# EAGLE design EncoderWing (EAGLE 6.3)
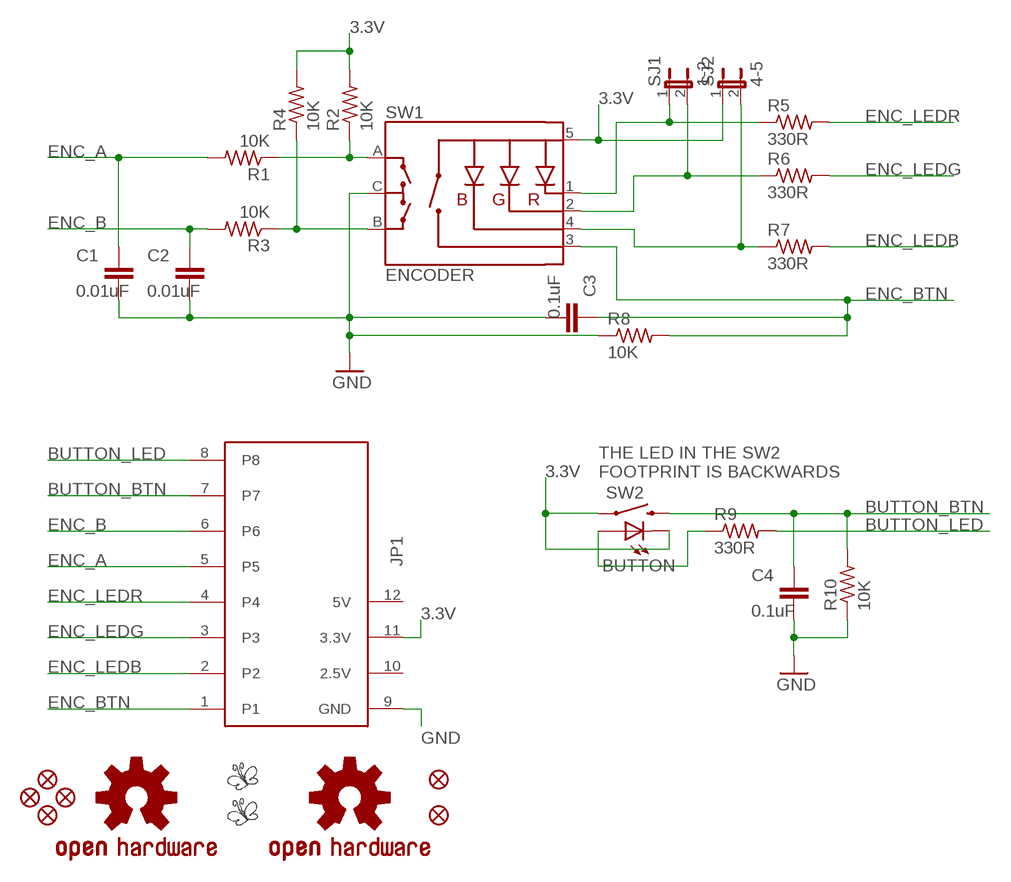
[diagram p0: schematic, sheet 1]

## Parts
C1  0.01uF  C-EUC0603  [C0603]
C2  0.01uF  C-EUC0603  [C0603]
C3  0.1uF  C-EUC0603  [C0603]
C4  0.1uF  C-EUC0603  [C0603]
FID1  FIDUCIALUFIDUCIAL  [MICRO-FIDUCIAL]
FID2  FIDUCIALUFIDUCIAL  [MICRO-FIDUCIAL]
FID3  FIDUCIALUFIDUCIAL  [MICRO-FIDUCIAL]
FID4  FIDUCIALUFIDUCIAL  [MICRO-FIDUCIAL]
FID5  FIDUCIALUFIDUCIAL  [MICRO-FIDUCIAL]
FID6  FIDUCIALUFIDUCIAL  [MICRO-FIDUCIAL]
JP1  PAPILIO-WING-8BITS  [PAPILIO-WING-8BITS]
LOGO1  BUTTERFLY_LOGO  [BUTTERFLY_LOGO]
LOGO2  BUTTERFLY_LOGO  [BUTTERFLY_LOGO]
R1  10K  R-US_R0603  [R0603]
R2  10K  R-US_R0603  [R0603]
R3  10K  R-US_R0603  [R0603]
R4  10K  R-US_R0603  [R0603]
R5  330R  R-US_R0603  [R0603]
R6  330R  R-US_R0603  [R0603]
R7  330R  R-US_R0603  [R0603]
R8  10K  R-US_R0603  [R0603]
R9  330R  R-US_R0603  [R0603]
R10  10K  R-US_R0603  [R0603]
SJ1  1-2  JUMPER-2SMD-NO  [SJ_2S-NO]
SJ2  4-5  JUMPER-2SMD-NO  [SJ_2S-NO]
SW1  ENCODER  ENCODER_RGB_CA  [ENCODER_LED_3]
SW2  BUTTON  SWITCH-MOMENTARY-LEDPTH  [TACTILE-PTH-LED-12MM]
U$2  OSHW-LOGOS  [OSHW-LOGO-S]
U$3  OSHW-LOGOS  [OSHW-LOGO-S]

## Nets
3.3V: JP1.11(3.3V) R2.2 R4.2 SJ2.1 SW1.5(+) SW2.4 SW2.C
BACK_LED_RES: R9.1 SW2.A
BUTTON_BTN: C4.1 JP1.7 R10.2 SW2.2
BUTTON_LED: JP1.8 R9.2
ENC_A: C1.1 JP1.5 R1.2
ENC_A_RES: R1.1 R2.1 SW1.A
ENC_B: C2.1 JP1.6 R3.2
ENC_B_RES: R3.1 R4.1 SW1.B
ENC_BTN: C3.1 JP1.1 R8.2 SW1.3(SW)
ENC_LEDB: JP1.2 R7.2
ENC_LEDB_RES: R7.1 SJ2.2 SW1.4(-B)
ENC_LEDG: JP1.3 R6.2
ENC_LEDG_RES: R6.1 SJ1.2 SW1.2(-G)
ENC_LEDR: JP1.4 R5.2
ENC_LEDR_RES: R5.1 SJ1.1 SW1.1(-R)
GND: C1.2 C2.2 C3.2 C4.2 JP1.9(GND) R8.1 R10.1 SW1.C
Unconnected: JP1.10(2.5V) JP1.12(5V)

## Notes on the sheet
- THE LED IN THE SW2
  FOOTPRINT IS BACKWARDS

## Library data of the parts
C1-C4 = rcl:C-EU: CAPACITOR, European symbol
FID1-FID6 = SparkFun-Aesthetics:FIDUCIAL: Fiducial Alignment Points Various fiducial points for machine vision alignment.
JP1 = logxen:PAPILIO-WING-8BITS
LOGO1 LOGO2 = GadgetFactory_Pub:BUTTERFLY_LOGO
R1-R10 = resistor:R-US_: RESISTOR, American symbol
SJ1 SJ2 = SparkFun-Passives:JUMPER-2: Jumper Basic 0.1" spaced jumper. Use with breakaway headers.
SW1 = SparkFun:ENCODER_RGB_CA: Illuminated Rotary Encoder w/ RGB LED and select switch EC12PLRGBSDVBF-D: http://top-up.so-buy.com/front/bin/ptdetail.phtml?Part=EC12PLRGBSDVBF-D
SW2 = Local Library:SWITCH-MOMENTARY-LED
U$2 U$3 = SparkFun-Aesthetics:OSHW-LOGO: Open Source Hardware Logo This logo indicates the piece of hardware it is found on incorporates a OSHW license and/or adheres to the definition of open source hardware found here: http://freedomdefined.org/OSHW

## Board
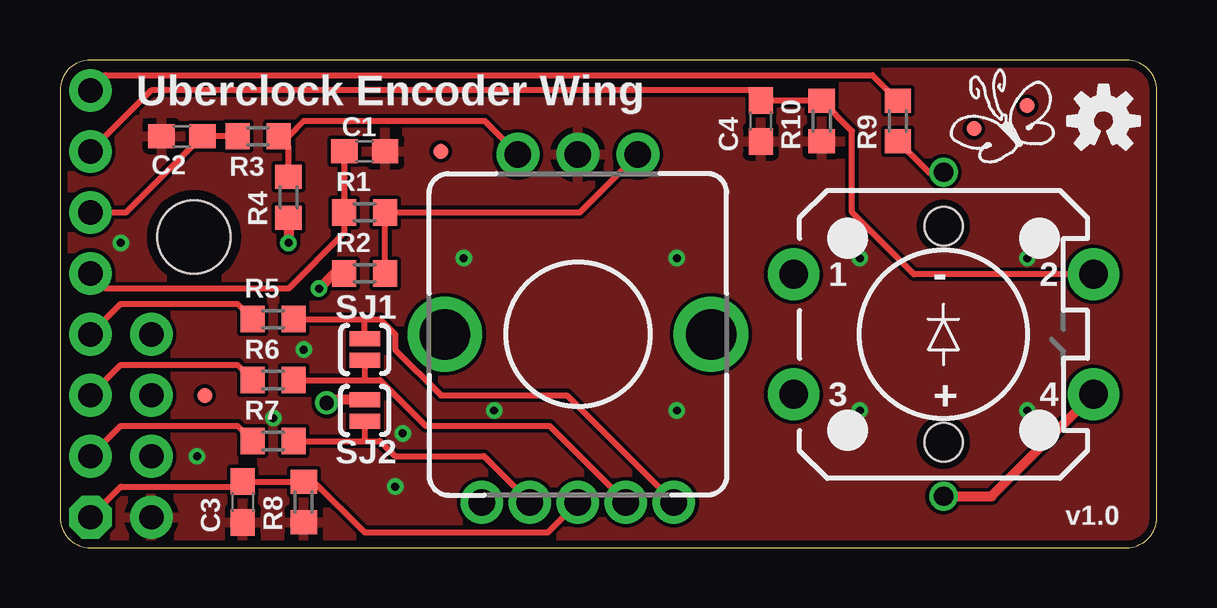
[diagram p1: board, top side]
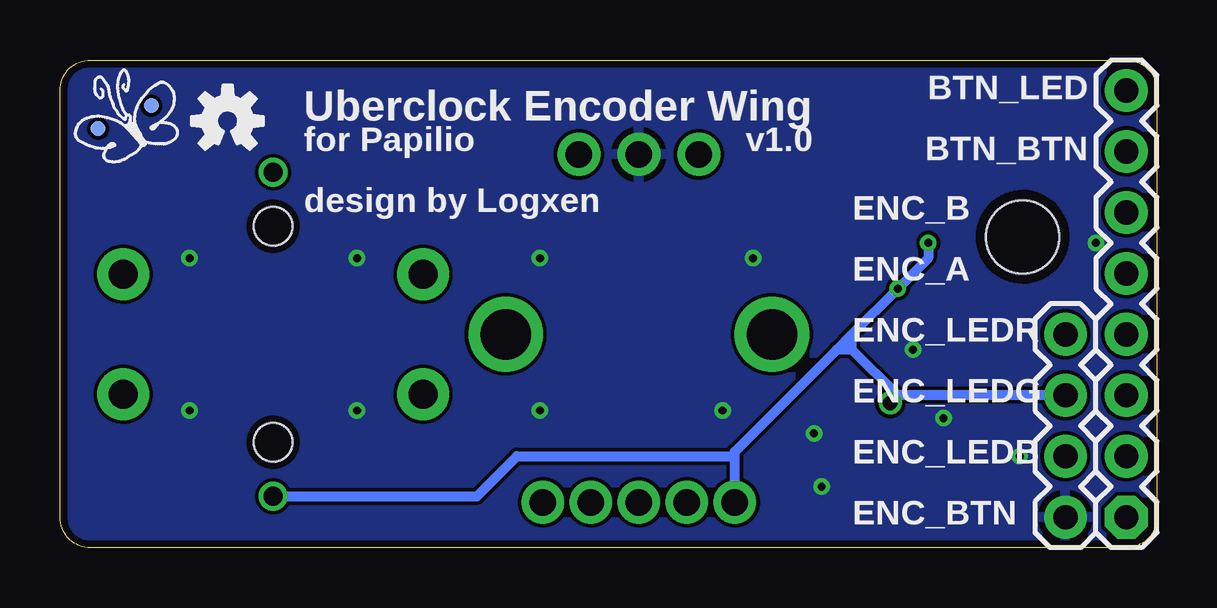
[diagram p2: board, bottom side, seen from below]

Size 45.72 x 20.32 mm. Coordinates in mm from the lower left corner, seen from the top.
Outline: 0,1.27 arc90 1.27,0 44.45,0 arc90 45.72,1.27 45.72,19.05 arc90 44.45,20.32 1.27,20.32 arc90 0,19.05 0,1.27
Copper layers (1*16): Top 0.0356mm / dielectric 1.5011mm / Bottom 0.0356mm
Design rules "LaenPCBOrder *": minimum track width 6mil, minimum drill 13mil, track to track 6mil, track to pad 6mil, pad to pad 6mil, via to via 6mil, smd to smd 6mil, copper to edge 12mil, drill to drill 6mil, minimum pad ring 7mil, minimum via ring 7mil, stop-mask expansion 4mil, vias tented up to drill 24mil, thermal gap 10mil

### Footprints (pad centres in the part's own frame; a part is rotated, then mirrored left to right if it is on the bottom)
C0603 = smd 1.1 x 1: 1 -0.85,0; 2 0.85,0
MICRO-FIDUCIAL = smd 0.635 x 0.635: 1 0,0
PAPILIO-WING-8BITS = drill 1.016 pad 1.778 octagon: 1 0,0 | drill 1.016 pad 1.778: 2 0,2.54; 3 0,5.08; 4 0,7.62; 5 0,10.16; 6 0,12.7; 7 0,15.24; 8 0,17.78; 9 2.54,0; 10 2.54,2.54; 11 2.54,5.08; 12 2.54,7.62 | hole 3.048: 4.318,11.684
R0603 = smd 1 x 1.1: 1 -0.85,0; 2 0.85,0
SJ_2S-NO = smd 0.635 x 1.27: 1 -0.45,0; 2 0.45,0
ENCODER_LED_3 = drill 1.1 pad 1.778: 1 -4,7; 2 -2,7; 3 0,7; 4 2,7; 5 4,7 | drill 1.1 pad 1.8: A -2.5,-7.5; B 2.5,-7.5; C 0,-7.5 | drill 2.1: M1 -5.55,0; M2 5.55,0
TACTILE-PTH-LED-12MM = drill 1.2 pad 2.159: 1 -6.25,2.5; 2 6.25,2.5; 3 -6.25,-2.5; 4 6.25,-2.5 | drill 0.8: A 0,6.75; C 0,-6.75 | hole 1.6: 0,4.5; 0,-4.5

### Placement (x,y rotation side)
C1  12.7,16.51 0 top
C2  5.08,17.14 180 top
C3  7.62,1.91 270 top
C4  29.21,17.78 270 top
FID1  40.32,18.41 0 top
FID2  38.1,17.46 0 top
FID3  41.91,18.41 0 bottom
FID4  44.13,17.46 0 bottom
FID5  6.03,6.35 0 top
FID6  15.88,16.51 0 top
JP1  1.27,1.27 0 top
LOGO1  42.86,17.46 0 bottom
LOGO2  39.37,17.46 0 top
R1  12.7,13.97 180 top
R2  12.7,11.43 180 top
R3  8.26,17.14 180 top
R4  9.53,14.61 270 top
R5  8.89,9.53 180 top
R6  8.89,6.99 180 top
R7  8.89,4.45 180 top
R8  10.16,1.91 90 top
R9  34.92,17.78 90 top
R10  31.75,17.78 90 top
SJ1  12.7,8.26 270 top
SJ2  12.7,5.71 270 top
SW1  21.59,8.89 180 top
SW2  36.83,8.89 0 top
U$2  38.73,17.78 0 bottom
U$3  43.5,17.78 0 top

### Tracks (layer width: path | path; a pad name or v marks a point on that pad's centre or on a via)
3.3V  (via drill 0.33, 0.6)
  Top 0.406: SW2.C 38.83,2.14 SW2.4 | R2.2 11.43,11.43 v10.79,10.79 | R4.2 v9.53,12.7 | SJ2.1 11.24,6.17 v11.11,6.03
  Bottom 0.406: SW2.C 28.34,2.14 26.67,3.81 17.59,3.81 | SW1.5 17.59,3.81 | 17.59,3.81 17.59,4 13.34,8.26 | 13.34,8.26 12.7,8.89 | 12.7,8.89 v10.79,10.79 9.53,12.06 v9.53,12.7 | JP1.11 10.79,6.35 | 10.79,6.35 12.7,8.26 | 12.7,8.26 12.7,8.89 | 12.7,8.26 13.34,8.26 | 10.79,6.35 v11.11,6.03
BACK_LED_RES
  Top 0.254: SW2.A 36.22,15.64 R9.1
BUTTON_BTN
  Top 0.254: SW2.2 35.6,11.39 33.02,13.97 33.02,17.36 R10.2 C4.1 28.79,19.05 3.81,19.05 JP1.7
BUTTON_LED
  Top 0.254: JP1.8 1.91,19.68 33.87,19.68 R9.2
ENC_A
  Top 0.254: C1.1 R1.2 11.85,13.12 9.53,10.79 1.91,10.79 JP1.5
ENC_A_RES
  Top 0.254: R2.1 R1.1 21.67,13.97 SW1.A
ENC_B
  Top 0.254: JP1.6 2.75,13.97 C2.1 R3.2
ENC_B_RES
  Top 0.254: R4.1 9.53,16.73 R3.1 9.53,17.14 10.16,17.78 17.7,17.78 SW1.B
ENC_BTN
  Top 0.254: JP1.1 2.54,2.54 7.41,2.54 C3.1 R8.2 | R8.2 10.58,2.75 12.7,0.64 20.34,0.64 SW1.3 | 10.16,2.73 R8.2
ENC_LEDB
  Top 0.254: JP1.2 2.54,5.08 7.41,5.08 R7.2
ENC_LEDB_RES
  Top 0.254: R7.1 12.7,4.45 | 12.7,4.45 13.34,4.45 13.97,3.81 17.67,3.81 SW1.4 | SJ2.2 12.7,4.45
ENC_LEDG
  Top 0.254: JP1.3 2.54,7.62 7.41,7.62 R6.2
ENC_LEDG_RES
  Top 0.254: R6.1 12.7,6.99 | 12.7,6.99 13.34,6.99 15.24,5.08 20.4,5.08 SW1.2 | SJ1.2 12.7,6.99
ENC_LEDR
  Top 0.254: JP1.4 2.54,10.16 7.41,10.16 R5.2
ENC_LEDR_RES
  Top 0.254: R5.1 12.7,9.53 | 12.7,9.53 13.34,9.53 13.97,8.89 13.97,8.26 15.88,6.35 21.13,6.35 SW1.1 | SJ1.1 12.7,9.53
GND  (via drill 0.33)
  other vias: 10.16,8.26 8.89,5.4 13.97,2.54 5.71,3.81 2.54,12.7 14.29,4.76 18.1,5.71 25.72,5.71 16.83,12.06 25.72,12.06 33.34,12.06 33.34,5.71 40.32,5.71 40.32,12.06
  pour Bottom: -1.27,21.59 46.99,21.59 46.99,-1.27 -1.27,-1.27
  pour Top: -2.54,22.86 48.26,22.86 48.26,-2.54 -2.54,-2.54

### Text on the board
tPlace: Uberclock Encoder Wing | v1.0
bPlace: BTN_LED | Uberclock Encoder Wing | BTN_BTN | v1.0 | for Papilio | ENC_B | design by Logxen | ENC_A | ENC_LEDR | ENC_LEDG | ENC_LEDB | ENC_BTN